# Altium schematic sheet con-right-top.SchDoc: Copper Suicide - Right Top
size Letter; CheckedBy: E. Chiu; CompanyName: Signal Laboratories, Inc.; DrawnBy: J. Brinton; Engineer: J. Brinton; Address1: 3479 Edison Way; Address2: Menlo Park CA 94025; Address3: +1 (877) 778-8435; Address4: siglabs.com; Revision: 1; SheetNumber: 31; SheetTotal: 44
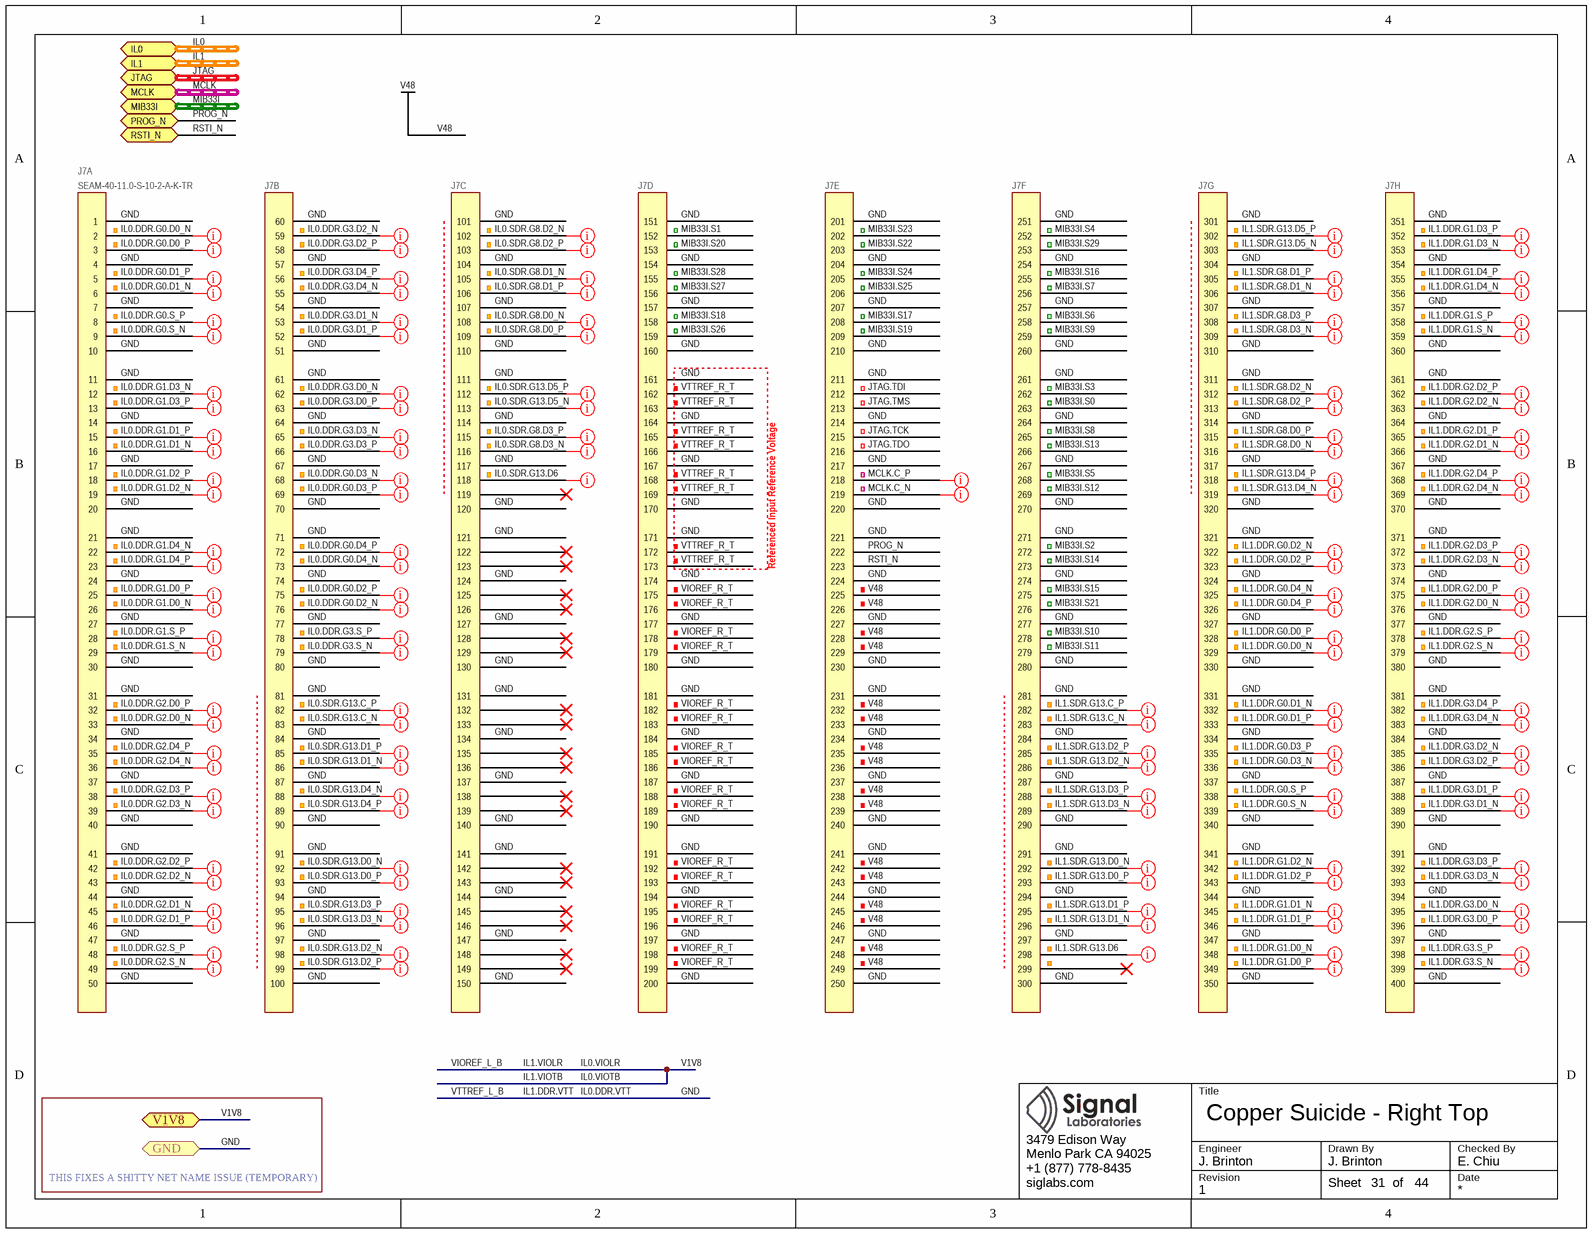
[diagram p0: con-right-top.SchDoc]

## Parts
J7  SEAM-40-11.0-S-10-2-A-K-TR  [SEAM-40-11.0-S-10-2-A-K-TR]  (parts A,B,C,D,E,F,G,H of 8)

## Ports
GND, IL0 (harness IL), IL1 (harness IL), JTAG (harness JTAG-3V3), MCLK (harness CLK-LVPECL33), MIB33I (harness MIB), PROG_N (bidir), RSTI_N (bidir), V1V8

## Nets
V48: J7.225 J7.226 J7.228 J7.229 J7.232 J7.233 J7.235 J7.236 J7.238 J7.239 J7.242 J7.243 J7.245 J7.246 J7.248 J7.249
GND: J7.1 J7.4 J7.7 J7.10 J7.11 J7.14 J7.17 J7.20 J7.21 J7.24 J7.27 J7.30 J7.31 J7.34 J7.37 J7.40 J7.41 J7.44 J7.47 J7.50 J7.51 J7.54 J7.57 J7.60 J7.61 J7.64 J7.67 J7.70 J7.71 J7.74 J7.77 J7.80 J7.81 J7.84 J7.87 J7.90 J7.91 J7.94 J7.97 J7.100 J7.101 J7.104 J7.107 J7.110 J7.111 J7.114 J7.117 J7.120 J7.121 J7.124 J7.127 J7.130 J7.131 J7.134 J7.137 J7.140 J7.141 J7.144 J7.147 J7.150 J7.151 J7.154 J7.157 J7.160 J7.161 J7.164 J7.167 J7.170 J7.171 J7.174 J7.177 J7.180 J7.181 J7.184 J7.187 J7.190 J7.191 J7.194 J7.197 J7.200 J7.201 J7.204 J7.207 J7.210 J7.211 J7.214 J7.217 J7.220 J7.221 J7.224 J7.227 J7.230 J7.231 J7.234 J7.237 J7.240 J7.241 J7.244 J7.247 J7.250 J7.251 J7.254 J7.257 J7.260 J7.261 J7.264 J7.267 J7.270 J7.271 J7.274 J7.277 J7.280 J7.281 J7.284 J7.287 J7.290 J7.291 J7.294 J7.297 J7.300 J7.301 J7.304 J7.307 J7.310 J7.311 J7.314 J7.317 J7.320 J7.321 J7.324 J7.327 J7.330 J7.331 J7.334 J7.337 J7.340 J7.341 J7.344 J7.347 J7.350 J7.351 J7.354 J7.357 J7.360 J7.361 J7.364 J7.367 J7.370 J7.371 J7.374 J7.377 J7.380 J7.381 J7.384 J7.387 J7.390 J7.391 J7.394 J7.397 J7.400 ; port GND  [also labelled IL0.DDR.VTT, IL1.DDR.VTT, VTTREF_L_B]
IL0.DDR.G0.D0_N: J7.2
IL0.DDR.G0.D0_P: J7.3
IL0.DDR.G0.D1_N: J7.6
IL0.DDR.G0.D1_P: J7.5
IL0.DDR.G0.D2_N: J7.76
IL0.DDR.G0.D2_P: J7.75
IL0.DDR.G0.D3_N: J7.68
IL0.DDR.G0.D3_P: J7.69
IL0.DDR.G0.D4_N: J7.73
IL0.DDR.G0.D4_P: J7.72
IL0.DDR.G0.S_N: J7.9
IL0.DDR.G0.S_P: J7.8
IL0.DDR.G1.D0_N: J7.26
IL0.DDR.G1.D0_P: J7.25
IL0.DDR.G1.D1_N: J7.16
IL0.DDR.G1.D1_P: J7.15
IL0.DDR.G1.D2_N: J7.19
IL0.DDR.G1.D2_P: J7.18
IL0.DDR.G1.D3_N: J7.12
IL0.DDR.G1.D3_P: J7.13
IL0.DDR.G1.D4_N: J7.22
IL0.DDR.G1.D4_P: J7.23
IL0.DDR.G1.S_N: J7.29
IL0.DDR.G1.S_P: J7.28
IL0.DDR.G2.D0_N: J7.33
IL0.DDR.G2.D0_P: J7.32
IL0.DDR.G2.D1_N: J7.45
IL0.DDR.G2.D1_P: J7.46
IL0.DDR.G2.D2_N: J7.43
IL0.DDR.G2.D2_P: J7.42
IL0.DDR.G2.D3_N: J7.39
IL0.DDR.G2.D3_P: J7.38
IL0.DDR.G2.D4_N: J7.36
IL0.DDR.G2.D4_P: J7.35
IL0.DDR.G2.S_N: J7.49
IL0.DDR.G2.S_P: J7.48
IL0.DDR.G3.D0_N: J7.62
IL0.DDR.G3.D0_P: J7.63
IL0.DDR.G3.D1_N: J7.53
IL0.DDR.G3.D1_P: J7.52
IL0.DDR.G3.D2_N: J7.59
IL0.DDR.G3.D2_P: J7.58
IL0.DDR.G3.D3_N: J7.65
IL0.DDR.G3.D3_P: J7.66
IL0.DDR.G3.D4_N: J7.55
IL0.DDR.G3.D4_P: J7.56
IL0.DDR.G3.S_N: J7.79
IL0.DDR.G3.S_P: J7.78
IL0.SDR.G8.D0_N: J7.108
IL0.SDR.G8.D0_P: J7.109
IL0.SDR.G8.D1_N: J7.105
IL0.SDR.G8.D1_P: J7.106
IL0.SDR.G8.D2_N: J7.102
IL0.SDR.G8.D2_P: J7.103
IL0.SDR.G8.D3_N: J7.116
IL0.SDR.G8.D3_P: J7.115
IL0.SDR.G13.C_N: J7.83
IL0.SDR.G13.C_P: J7.82
IL0.SDR.G13.D0_N: J7.92
IL0.SDR.G13.D0_P: J7.93
IL0.SDR.G13.D1_N: J7.86
IL0.SDR.G13.D1_P: J7.85
IL0.SDR.G13.D2_N: J7.98
IL0.SDR.G13.D2_P: J7.99
IL0.SDR.G13.D3_N: J7.96
IL0.SDR.G13.D3_P: J7.95
IL0.SDR.G13.D4_N: J7.88
IL0.SDR.G13.D4_P: J7.89
IL0.SDR.G13.D5_N: J7.113
IL0.SDR.G13.D5_P: J7.112
IL0.SDR.G13.D6: J7.118
IL0.VIOLR: port V1V8  [also labelled IL0.VIOTB, IL1.VIOLR, IL1.VIOTB, V1V8, VIOREF_L_B]
IL1.DDR.G0.D0_N: J7.329
IL1.DDR.G0.D0_P: J7.328
IL1.DDR.G0.D1_N: J7.332
IL1.DDR.G0.D1_P: J7.333
IL1.DDR.G0.D2_N: J7.322
IL1.DDR.G0.D2_P: J7.323
IL1.DDR.G0.D3_N: J7.336
IL1.DDR.G0.D3_P: J7.335
IL1.DDR.G0.D4_N: J7.325
IL1.DDR.G0.D4_P: J7.326
IL1.DDR.G0.S_N: J7.339
IL1.DDR.G0.S_P: J7.338
IL1.DDR.G1.D0_N: J7.348
IL1.DDR.G1.D0_P: J7.349
IL1.DDR.G1.D1_N: J7.345
IL1.DDR.G1.D1_P: J7.346
IL1.DDR.G1.D2_N: J7.342
IL1.DDR.G1.D2_P: J7.343
IL1.DDR.G1.D3_N: J7.353
IL1.DDR.G1.D3_P: J7.352
IL1.DDR.G1.D4_N: J7.356
IL1.DDR.G1.D4_P: J7.355
IL1.DDR.G1.S_N: J7.359
IL1.DDR.G1.S_P: J7.358
IL1.DDR.G2.D0_N: J7.376
IL1.DDR.G2.D0_P: J7.375
IL1.DDR.G2.D1_N: J7.366
IL1.DDR.G2.D1_P: J7.365
IL1.DDR.G2.D2_N: J7.363
IL1.DDR.G2.D2_P: J7.362
IL1.DDR.G2.D3_N: J7.373
IL1.DDR.G2.D3_P: J7.372
IL1.DDR.G2.D4_N: J7.369
IL1.DDR.G2.D4_P: J7.368
IL1.DDR.G2.S_N: J7.379
IL1.DDR.G2.S_P: J7.378
IL1.DDR.G3.D0_N: J7.395
IL1.DDR.G3.D0_P: J7.396
IL1.DDR.G3.D1_N: J7.389
IL1.DDR.G3.D1_P: J7.388
IL1.DDR.G3.D2_N: J7.385
IL1.DDR.G3.D2_P: J7.386
IL1.DDR.G3.D3_N: J7.393
IL1.DDR.G3.D3_P: J7.392
IL1.DDR.G3.D4_N: J7.383
IL1.DDR.G3.D4_P: J7.382
IL1.DDR.G3.S_N: J7.399
IL1.DDR.G3.S_P: J7.398
IL1.SDR.G8.D0_N: J7.316
IL1.SDR.G8.D0_P: J7.315
IL1.SDR.G8.D1_N: J7.306
IL1.SDR.G8.D1_P: J7.305
IL1.SDR.G8.D2_N: J7.312
IL1.SDR.G8.D2_P: J7.313
IL1.SDR.G8.D3_N: J7.309
IL1.SDR.G8.D3_P: J7.308
IL1.SDR.G13.C_N: J7.283
IL1.SDR.G13.C_P: J7.282
IL1.SDR.G13.D0_N: J7.292
IL1.SDR.G13.D0_P: J7.293
IL1.SDR.G13.D1_N: J7.296
IL1.SDR.G13.D1_P: J7.295
IL1.SDR.G13.D2_N: J7.286
IL1.SDR.G13.D2_P: J7.285
IL1.SDR.G13.D3_N: J7.289
IL1.SDR.G13.D3_P: J7.288
IL1.SDR.G13.D4_N: J7.319
IL1.SDR.G13.D4_P: J7.318
IL1.SDR.G13.D5_N: J7.303
IL1.SDR.G13.D5_P: J7.302
IL1.SDR.G13.D6: J7.298
JTAG.TCK: J7.215
JTAG.TDI: J7.212
JTAG.TDO: J7.216
JTAG.TMS: J7.213
MCLK.C_N: J7.219
MCLK.C_P: J7.218
MIB33I.S0: J7.263
MIB33I.S1: J7.152
MIB33I.S2: J7.272
MIB33I.S3: J7.262
MIB33I.S4: J7.252
MIB33I.S5: J7.268
MIB33I.S6: J7.258
MIB33I.S7: J7.256
MIB33I.S8: J7.265
MIB33I.S9: J7.259
MIB33I.S10: J7.278
MIB33I.S11: J7.279
MIB33I.S12: J7.269
MIB33I.S13: J7.266
MIB33I.S14: J7.273
MIB33I.S15: J7.275
MIB33I.S16: J7.255
MIB33I.S17: J7.208
MIB33I.S18: J7.158
MIB33I.S19: J7.209
MIB33I.S20: J7.153
MIB33I.S21: J7.276
MIB33I.S22: J7.203
MIB33I.S23: J7.202
MIB33I.S24: J7.205
MIB33I.S25: J7.206
MIB33I.S26: J7.159
MIB33I.S27: J7.156
MIB33I.S28: J7.155
MIB33I.S29: J7.253
PROG_N: J7.222 ; port PROG_N
RSTI_N: J7.223 ; port RSTI_N
VIOREF_R_T: J7.175 J7.176 J7.178 J7.179 J7.182 J7.183 J7.185 J7.186 J7.188 J7.189 J7.192 J7.193 J7.195 J7.196 J7.198 J7.199
VTTREF_R_T: J7.162 J7.163 J7.165 J7.166 J7.168 J7.169 J7.172 J7.173

Not connected (* = marked no-connect by the designer): J7 119* 122* 123* 125* 126* 128* 129* 132* 133* 135* 136* 138* 139* 142* 143* 145* 146* 148* 149* 299*

## Buses and harness runs
harness IL0 = port IL0
harness IL1 = port IL1
harness JTAG = port JTAG
harness MCLK = port MCLK
harness MIB33I = port MIB33I

## Layout directives
net class z50: IL0.SDR.G13.D6, IL1.SDR.G13.D6
net class z50; differential pair; net class loose: IL0.DDR.G0.D0_N, IL0.DDR.G0.D0_P, IL0.DDR.G0.D1_N, IL0.DDR.G0.D1_P, IL0.DDR.G0.D2_N, IL0.DDR.G0.D2_P, IL0.DDR.G0.D3_N, IL0.DDR.G0.D3_P, IL0.DDR.G0.D4_N, IL0.DDR.G0.D4_P, IL0.DDR.G0.S_N, IL0.DDR.G0.S_P, IL0.DDR.G1.D0_N, IL0.DDR.G1.D0_P, IL0.DDR.G1.D1_N, IL0.DDR.G1.D1_P, IL0.DDR.G1.D2_N, IL0.DDR.G1.D2_P, IL0.DDR.G1.D3_N, IL0.DDR.G1.D3_P, IL0.DDR.G1.D4_N, IL0.DDR.G1.D4_P, IL0.DDR.G1.S_N, IL0.DDR.G1.S_P, IL0.DDR.G2.D0_N, IL0.DDR.G2.D0_P, IL0.DDR.G2.D1_N, IL0.DDR.G2.D1_P, IL0.DDR.G2.D2_N, IL0.DDR.G2.D2_P, IL0.DDR.G2.D3_N, IL0.DDR.G2.D3_P, IL0.DDR.G2.D4_N, IL0.DDR.G2.D4_P, IL0.DDR.G2.S_N, IL0.DDR.G2.S_P, IL0.DDR.G3.D0_N, IL0.DDR.G3.D0_P, IL0.DDR.G3.D1_N, IL0.DDR.G3.D1_P, IL0.DDR.G3.D2_N, IL0.DDR.G3.D2_P, IL0.DDR.G3.D3_N, IL0.DDR.G3.D3_P, IL0.DDR.G3.D4_N, IL0.DDR.G3.D4_P, IL0.DDR.G3.S_N, IL0.DDR.G3.S_P, IL0.SDR.G8.D0_N, IL0.SDR.G8.D0_P, IL0.SDR.G8.D1_N, IL0.SDR.G8.D1_P, IL0.SDR.G8.D2_N, IL0.SDR.G8.D2_P, IL0.SDR.G8.D3_N, IL0.SDR.G8.D3_P, IL0.SDR.G13.C_N, IL0.SDR.G13.C_P, IL0.SDR.G13.D0_N, IL0.SDR.G13.D0_P, IL0.SDR.G13.D1_N, IL0.SDR.G13.D1_P, IL0.SDR.G13.D2_N, IL0.SDR.G13.D2_P, IL0.SDR.G13.D3_N, IL0.SDR.G13.D3_P, IL0.SDR.G13.D4_N, IL0.SDR.G13.D4_P, IL0.SDR.G13.D5_N, IL0.SDR.G13.D5_P, IL1.DDR.G0.D0_N, IL1.DDR.G0.D0_P, IL1.DDR.G0.D1_N, IL1.DDR.G0.D1_P, IL1.DDR.G0.D2_N, IL1.DDR.G0.D2_P, IL1.DDR.G0.D3_N, IL1.DDR.G0.D3_P, IL1.DDR.G0.D4_N, IL1.DDR.G0.D4_P, IL1.DDR.G0.S_N, IL1.DDR.G0.S_P, IL1.DDR.G1.D0_N, IL1.DDR.G1.D0_P, IL1.DDR.G1.D1_N, IL1.DDR.G1.D1_P, IL1.DDR.G1.D2_N, IL1.DDR.G1.D2_P, IL1.DDR.G1.D3_N, IL1.DDR.G1.D3_P, IL1.DDR.G1.D4_N, IL1.DDR.G1.D4_P, IL1.DDR.G1.S_N, IL1.DDR.G1.S_P, IL1.DDR.G2.D0_N, IL1.DDR.G2.D0_P, IL1.DDR.G2.D1_N, IL1.DDR.G2.D1_P, IL1.DDR.G2.D2_N, IL1.DDR.G2.D2_P, IL1.DDR.G2.D3_N, IL1.DDR.G2.D3_P, IL1.DDR.G2.D4_N, IL1.DDR.G2.D4_P, IL1.DDR.G2.S_N, IL1.DDR.G2.S_P, IL1.DDR.G3.D0_N, IL1.DDR.G3.D0_P, IL1.DDR.G3.D1_N, IL1.DDR.G3.D1_P, IL1.DDR.G3.D2_N, IL1.DDR.G3.D2_P, IL1.DDR.G3.D3_N, IL1.DDR.G3.D3_P, IL1.DDR.G3.D4_N, IL1.DDR.G3.D4_P, IL1.DDR.G3.S_N, IL1.DDR.G3.S_P, IL1.SDR.G8.D0_N, IL1.SDR.G8.D0_P, IL1.SDR.G8.D1_N, IL1.SDR.G8.D1_P, IL1.SDR.G8.D2_N, IL1.SDR.G8.D2_P, IL1.SDR.G8.D3_N, IL1.SDR.G8.D3_P, IL1.SDR.G13.C_N, IL1.SDR.G13.C_P, IL1.SDR.G13.D0_N, IL1.SDR.G13.D0_P, IL1.SDR.G13.D1_N, IL1.SDR.G13.D1_P, IL1.SDR.G13.D2_N, IL1.SDR.G13.D2_P, IL1.SDR.G13.D3_N, IL1.SDR.G13.D3_P, IL1.SDR.G13.D4_N, IL1.SDR.G13.D4_P, IL1.SDR.G13.D5_N, IL1.SDR.G13.D5_P
net class z50; differential pair; net class tight: MCLK.C_N, MCLK.C_P

## Notes on the sheet
- Referenced Input Reference Voltage
- THIS FIXES A SHITTY NET NAME ISSUE (TEMPORARY)
- Title
- Engineer
- Revision
- Drawn By
- Checked By
- Date
- Sheet
- of

## Library data of the parts
J7 = SEAM-40-11.0-S-10-2-A-K-TR: Terminal Array Assembly, Surface Mount, 0.050" Pitch, 400 Pins; Manufacturer: Samtec; Manufacturer P/N: SEAM-40-11.0-S-10-2-A-K-TR